# Altium schematic sheet PROC099A_PMIC_Reference.SchDoc: PMIC
size 431 x 279 mm; Date: Not shown in title block; ApprovedBy: Not shown in title block; CheckedBy: Not shown in title block; Author: Not shown in title block; CompanyName: Not shown in title block; DrawnBy: Adrian Ozer; Engineer: Not shown in title block; Organization: Not shown in title block; Address1: Not shown in title block; Address2: Not shown in title block; Address3: Not shown in title block; Address4: Not shown in title block; DocumentNumber: 4; Revision: Use project parameter SCH_Rev; SheetNumber: 4; SheetTotal: 16; PageSetup: Record=PageOptions|CenterHorizontal=True|CenterVertical=True|PrintScale=1.00|XCorrection=1.00|YCorrection=1.00|PrintKind=0|BorderSize=5000000|LeftOffset=0|BottomOffset=0|Orientation=2|PaperLength=1000|PaperWidth=1000|Scale=100|PaperSource=15|PrintQuality=600|MediaType=1|DitherType=10|PaperKind=Letter|PrintScaleMode=1; CurrentTime: Not shown in title block; CurrentDate: Not shown in title block; Time: Not shown in title block; DocumentFullPathAndName: Not shown in title block; DocumentName: Not shown in title block; ModifiedDate: Not shown in title block; ImagePath: Not shown in title block
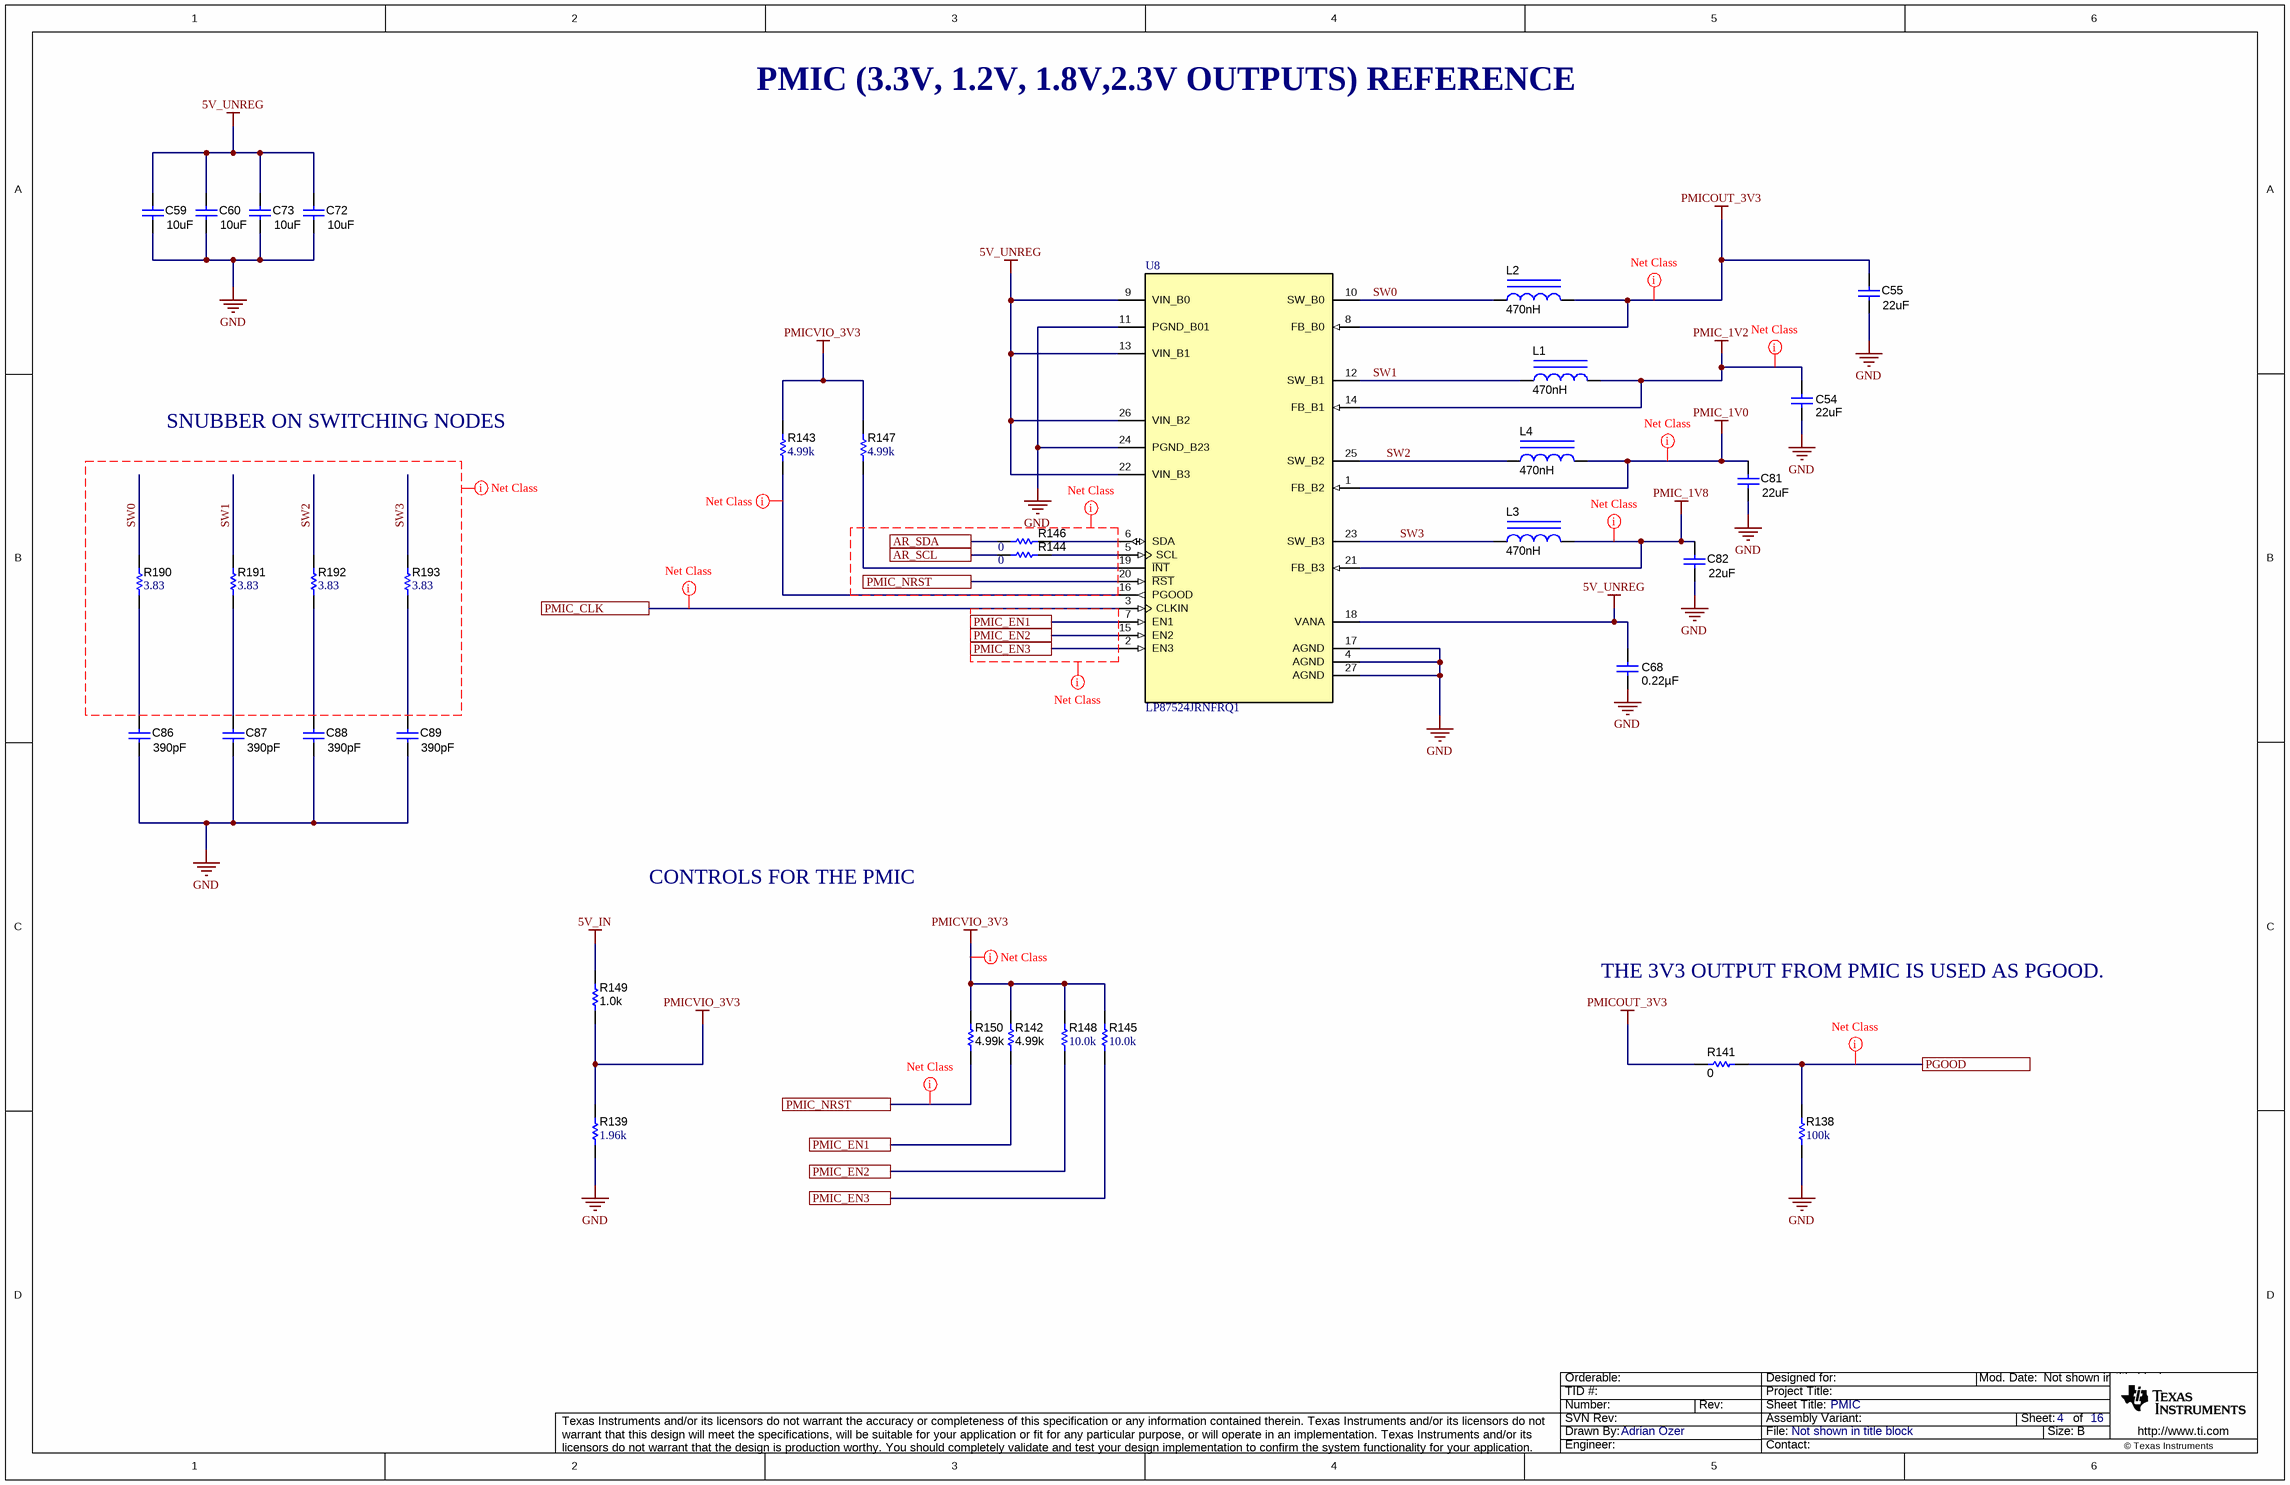
[diagram p0: PROC099A_PMIC_Reference.SchDoc]

## Parts
C54  ValueDisplayed: 22uF  [1206_180]  (hidden comment: GCM31CR71A226KE02)
C55  ValueDisplayed: 22uF  [1206_180]  (hidden comment: GCM31CR71A226KE02)
C59  ValueDisplayed: 10uF  [0805_HV1]  (hidden comment: GCM21BR71A106KE22L)
C60  ValueDisplayed: 10uF  [0805_HV1]  (hidden comment: GCM21BR71A106KE22L)
C68  ValueDisplayed: 0.22µF  [0402L]  (hidden comment: GCM155R71C224KE02D)
C72  ValueDisplayed: 10uF  [0805_HV1]  (hidden comment: GCM21BR71A106KE22L)
C73  ValueDisplayed: 10uF  [0805_HV1]  (hidden comment: GCM21BR71A106KE22L)
C81  ValueDisplayed: 22uF  [1206_180]  (hidden comment: GCM31CR71A226KE02)
C82  ValueDisplayed: 22uF  [1206_180]  (hidden comment: GCM31CR71A226KE02)
C86  ValueDisplayed: 390pF  [0402]  (hidden comment: GRM1555C1H391JA01D)
C87  ValueDisplayed: 390pF  [0402]  (hidden comment: GRM1555C1H391JA01D)
C88  ValueDisplayed: 390pF  [0402]  (hidden comment: GRM1555C1H391JA01D)
C89  ValueDisplayed: 390pF  [0402]  (hidden comment: GRM1555C1H391JA01D)
L1  ValueDisplayed: 470nH  [DFE252012P]  (hidden comment: DFE252012P-R47M=P2)
L2  ValueDisplayed: 470nH  [DFE252012P]  (hidden comment: DFE252012P-R47M=P2)
L3  ValueDisplayed: 470nH  [DFE252012P]  (hidden comment: DFE252012P-R47M=P2)
L4  ValueDisplayed: 470nH  [DFE252012P]  (hidden comment: DFE252012P-R47M=P2)
R138  ValueDisplayed: 100k  [0402L]  (hidden comment: CRCW0402100KFKED)
R139  ValueDisplayed: 1.96k  [0402L]  (hidden comment: CRCW04021K96FKED)
R141  ValueDisplayed: 0  [0402L]  (hidden comment: ERJ-2GE0R00X)
R142  ValueDisplayed: 4.99k  [0402L]  (hidden comment: ERJ-2RKF4991X)
R143  ValueDisplayed: 4.99k  [0402L]  (hidden comment: CRCW04024K99FKED)
R144  ValueDisplayed: 0  [0201_Silk]  (hidden comment: CRCW02010000Z0ED)
R145  ValueDisplayed: 10.0k  [0402L]  (hidden comment: CRCW040210K0FKED)
R146  ValueDisplayed: 0  [0201_Silk]  (hidden comment: CRCW02010000Z0ED)
R147  ValueDisplayed: 4.99k  [0402L]  (hidden comment: CRCW04024K99FKED)
R148  ValueDisplayed: 10.0k  [0402L]  (hidden comment: CRCW040210K0FKED)
R149  ValueDisplayed: 1.0k  [0402L]  (hidden comment: ERJ-2GEJ102X)
R150  ValueDisplayed: 4.99k  [0402L]  (hidden comment: ERJ-2RKF4991X)
R190  ValueDisplayed: 3.83  [0402L]  (hidden comment: CRCW04023R83FKED)
R191  ValueDisplayed: 3.83  [0402L]  (hidden comment: CRCW04023R83FKED)
R192  ValueDisplayed: 3.83  [0402L]  (hidden comment: CRCW04023R83FKED)
R193  ValueDisplayed: 3.83  [0402L]  (hidden comment: CRCW04023R83FKED)
U8  LP87524JRNFRQ1  [RNF0026C]

## Ports
AR_SCL, AR_SDA, PGOOD, PMIC_CLK, PMIC_EN1, PMIC_EN2, PMIC_EN3, PMIC_NRST

## Nets
5V_IN: R149.2
5V_UNREG: C59.2 C60.2 C68.2 C72.2 C73.2 U8.9(VIN_B0) U8.13(VIN_B1) U8.18(VANA) U8.22(VIN_B3) U8.26(VIN_B2)
GND: C54.1 C55.1 C59.1 C60.1 C68.1 C72.1 C73.1 C81.1 C82.1 C86.2 C87.2 C88.2 C89.2 R138.1 R139.1 U8.4(AGND) U8.11(PGND_B01) U8.17(AGND) U8.24(PGND_B23) U8.27(AGND)
PMIC_1V0: C81.2 L4.2 U8.1(FB_B2)
PMIC_1V2: C54.2 L1.2 U8.14(FB_B1)
PMIC_1V8: C82.2 L3.2 U8.21(FB_B3)
PMICOUT_3V3: C55.2 L2.2 R141.1 U8.8(FB_B0)
PMICVIO_3V3: R139.2 R142.2 R143.2 R145.2 R147.2 R148.2 R149.1 R150.1
AR_SCL: R144.1 ; port AR_SCL
AR_SDA: R146.2 ; port AR_SDA
PGOOD: R138.2 R141.2 ; port PGOOD
PMIC_CLK: U8.3(CLKIN) ; port PMIC_CLK
PMIC_EN1: R142.1 U8.7(EN1) ; port PMIC_EN1
PMIC_EN2: R148.1 U8.15(EN2) ; port PMIC_EN2
PMIC_EN3: R145.1 U8.2(EN3) ; port PMIC_EN3
PMIC_NRST: R150.2 U8.20(~{RST}) ; port PMIC_NRST
SW0: L2.1 R190.2 U8.10(SW_B0)
SW1: L1.1 R191.2 U8.12(SW_B1)
SW2: L4.1 R192.2 U8.25(SW_B2)
SW3: L3.1 R193.2 U8.23(SW_B3)
NetC86_1: C86.1 R190.1
NetC87_1: C87.1 R191.1
NetC88_1: C88.1 R192.1
NetC89_1: C89.1 R193.1
NetR143_1: R143.1 U8.16(PGOOD)
NetR144_2: R144.2 U8.5(SCL)
NetR146_1: R146.1 U8.6(SDA)
NetR147_1: R147.1 U8.19(~{INT})

## Layout directives
net class PWR: PGOOD, PMIC_1V0, PMIC_1V2, PMIC_1V8, PMICOUT_3V3, PMICVIO_3V3
net class GENERAL: (no net found under the mark), NetR143_1, PMIC_NRST, SW0, SW1, SW2, SW3
net class CLK: PMIC_CLK

## Notes on the sheet
- PMIC (3.3V, 1.2V, 1.8V,2.3V OUTPUTS) REFERENCE
- SNUBBER ON SWITCHING NODES
- CONTROLS FOR THE PMIC
- THE 3V3 OUTPUT FROM PMIC IS USED AS PGOOD.
- Drawn By:
- SVN Rev:
- Number:
- TID #:
- Orderable:
- Rev:
- Sheet Title:
- File:
- Project Title:
- Designed for:
- Assembly Variant:
- Mod. Date:
- Sheet:
- Size:
- of
- B
- http://www.ti.com
- Texas Instruments and/or its licensors do not warrant the accuracy or completeness of this specification or any information contained therein. Texas Instruments and/or its licensors do not warrant that this design will meet the specifications, will be suitable for your application or fit for any particular purpose, or will operate in an implementation. Texas Instruments and/or its licensors do not warrant that the design is production worthy. You should completely validate and test your design implementation to confirm the system functionality for your application.
- Engineer:
- Contact:
- © Texas Instruments

## Library data of the parts
C54 = CMP-0008811-2: CAP, CERM, 22 uF, 10 V, +/- 10%, X7R, AEC-Q200 Grade 1, 1206; Manufacturer: MuRata; TaMin_C: -55°C; Polarized: N; SizeAreaWB_mm2: 10.92; Value1: Unknown; U/M: EA; Value: 22uF; TaMax_C: 125°C; SizeZ_mm: 1.8; SizeX_mm: 3.2; SizeY_mm: 1.6; Cap_Case: 1206; Value2: 10V; SizeArea_mm2: 5.12; CompType: Capacitor; AEC Qualified: Y; Cap_F: 22µF; AEC Grade: 1; AEC Category: Q200; Publisher: Texas Instruments; TempCo: X7R; Published: 2008-06-19; RoHS: Y; MountType: SMT; PackageReference: 1206; Tolerance_%: 10%; LatestRevisionDate: 2017-03-09; PartNumber: GCM31CR71A226KE02; VDC_V: 10V; ComponentLink1Description: Datasheet link; Technology: Ceramic; ComponentLink1URL: http://psearch.en.murata.com/capacitor/product/GCM31CR71A226KE02%23.pdf
C55 C81 C82 = CMP-0008811-2: CAP, CERM, 22 uF, 10 V, +/- 10%, X7R, AEC-Q200 Grade 1, 1206; Manufacturer: MuRata; TaMin_C: -55°C; Polarized: N; SizeAreaWB_mm2: 10.92; Value1: Unknown; U/M: EA; Value: 22uF; TaMax_C: 125°C; SizeZ_mm: 1.8; SizeX_mm: 3.2; SizeY_mm: 1.6; Cap_Case: 1206; Value2: 10V; SizeArea_mm2: 5.12; AEC Qualified: Y; Cap_F: 22µF; AEC Grade: 1; AEC Category: Q200; Publisher: Texas Instruments; TempCo: X7R; Published: 2008-06-19; RoHS: Y; MountType: SMT; PackageReference: 1206; Tolerance_%: 10%; CompType: Capacitor; LatestRevisionDate: 2017-03-09; PartNumber: GCM31CR71A226KE02; VDC_V: 10V; ComponentLink1Description: Datasheet link; Technology: Ceramic; ComponentLink1URL: http://psearch.en.murata.com/capacitor/product/GCM31CR71A226KE02%23.pdf
C59 C60 C72 C73 = CMP-0008017-2: CAP, CERM, 10 uF, 10 V, +/- 10%, X7R, 0805; Manufacturer: MuRata; TaMin_C: -55°C; Polarized: N; SizeAreaWB_mm2: 6.75; Value1: Unknown; U/M: EA; Value: 10uF; TaMax_C: 125°C; SizeZ_mm: 1.45; SizeX_mm: 2; SizeY_mm: 1.25; Cap_Case: 0805; Value2: 10V; SizeArea_mm2: 2.5; CompType: Capacitor; Cap_F: 10µF; AEC Category: Q200; Supplier Part Number 2: 06AC6014; Publisher: Texas Instruments; Supplier 2: Newark; Supplier Part Number 3: 81-GCM21BR71A106KE2L; TempCo: X7R; Supplier 3: Mouser; Published: 2008-06-19; RoHS: Y; MountType: SMT; Supplier 1: Digi-Key; PackageReference: 0805; Tolerance_%: 10%; LatestRevisionDate: 2017-03-09; PartNumber: GCM21BR71A106KE22L; AEC Qualified: ?; VDC_V: 10V; ComponentLink1Description: Datasheet link; Supplier Part Number 1: 490-10674-1-ND; Technology: Ceramic; ComponentLink1URL: http://www.murata.com/products/catalog/pdf/c03e.pdf
C68 = CMP-0078265-1: CAP, CERM, 0.22 µF, 16 V,+/- 10%, X7R, AEC-Q200 Grade 1, 0402; Manufacturer: MuRata; TaMin_C: -55°C; Polarized: N; SizeAreaWB_mm2: 3; U/M: EA; Value: 0.22uF; TaMax_C: 125°C; SizeZ_mm: 0.6; SizeX_mm: 1; SizeY_mm: 0.5; Cap_Case: 0402; Value2: 16V; CompType: Capacitor; AEC Qualified: Y; Cap_F: 220nF; AEC Category: Q200; ComponentLink1URL: http://psearch.en.murata.com/capacitor/product/GCM155R71C224KE02%23.pdf; Supplier Part Number 2: 81-GCM155R71C224KE2D; Supplier 2: Mouser; TempCo: X7R; RoHS: Y; MountType: SMT; Supplier 1: Digi-Key; PackageReference: 0402; Tolerance_%: 10%; SizeArea_mm2: 0.5; PartNumber: GCM155R71C224KE02D; VDC_V: 16V; ComponentLink1Description: Datasheet link; AEC Grade: 1; Supplier Part Number 1: 490-10671-1-ND; Technology: Ceramic
C86-C89 = CMP-0006459-1: CAP, CERM, 390 pF, 50 V, +/- 5%, C0G/NP0, 0402; Manufacturer: MuRata; TaMin_C: -55°C; Polarized: N; SizeAreaWB_mm2: 3; Value1: Unknown; U/M: EA; Value: 390pF; TaMax_C: 125°C; SizeZ_mm: 0.6; SizeX_mm: 1; SizeY_mm: 0.5; Value2: 50V; AEC Category: Q200; ComponentLink1URL: http://search.murata.co.jp/Ceramy/PnsearchViewAction.do?HnOFG=ON&HnNFG=ON&SEL_CNT=50&sLang=en&sKey=GRM1555C1H391JA01D&x=9&y=9&search=startwith; Supplier Part Number 2: 81-GRM1555C1H391JA01; Publisher: Texas Instruments; Supplier 2: Mouser; TempCo: C0G/NP0; Published: 2008-06-19; RoHS: Y; MountType: SMT; Supplier 1: Digi-Key; PackageReference: 0402; Tolerance_%: 5%; Cap_Case: 0402; SizeArea_mm2: 0.5; CompType: Capacitor; LatestRevisionDate: 2017-03-09; PartNumber: GRM1555C1H391JA01D; AEC Qualified: ?; Cap_F: 390pF; VDC_V: 50V; ComponentLink1Description: Datasheet link; Supplier Part Number 1: 490-1296-1-ND; Technology: Ceramic
L1-L4 = CMP-0058946-1: Inductor, Shielded, 470 nH, 4.7 A, 0.021 ohm, SMD; Manufacturer: MuRata Toko; Isat: 6.4A @ 30% inductance drop; Irms: 4.7A @ 40C rise; SizeAreaWB_mm2: 10.5; DCR_ohm: 0.021; Value: 470nH; Imax_A: 4.7A; SizeZ_mm: 1.2; SizeX_mm: 2.5; SizeY_mm: 2; SizeArea_mm2: 5; AEC Category: Q200; ComponentLink1URL: http://www.toko.co.jp/products/pdf/inductors/dfe252012p.pdf; Publisher: Texas Instruments; Published: 2008-06-26; RoHS: Y; Value1: 0.021 ohm; Material: ?; MountType: SMT; PackageReference: 1008; Value2: 4.7A; CompType: Inductor; Ind_H: 470nH; LatestRevisionDate: 2017-06-02; PartNumber: DFE252012P-R47M=P2; AEC Qualified: ?; ComponentLink1Description: Datasheet link; Technology: Shielded
R138 = CMP-0025950-3: RES, 100 k, 1%, 0.063 W, AEC-Q200 Grade 0, 0402; Manufacturer: Vishay-Dale; Power_W: 63mW; TempCo: 100 ppm/C; Value: 100k; EIA_Code: E96; SizeX_mm: 1; SizeY_mm: 0.5; SizeZ_mm: 0.6; Value2: 0.063W; AEC Qualified: Y; VDC_V: 50V; AEC Category: Q200; AEC Grade: 0; Supplier Part Number 2: 52K6607; Supplier 2: Newark; Supplier Part Number 3: 71-CRCW0402-100K-E3; Supplier 3: Mouser; Value_Code: 100k; RoHS: E; Value1: 1%; MountType: SMT; Supplier 1: Digi-Key; PackageReference: 0402; Tolerance_%: 1%; Res_ohm: 100k; SizeArea_mm2: 0.5; CompType: Resistor; PartNumber: CRCW0402100KFKED; ComponentLink1Description: Datasheet link; Supplier Part Number 1: 541-100KLCT-ND; Technology: Thick Film; ComponentLink1URL: http://www.vishay.com/docs/20035/dcrcwe3.pdf
R139 = CMP-0026099-2: RES, 1.96 k, 1%, 0.063 W, AEC-Q200 Grade 0, 0402; Manufacturer: Vishay-Dale; Power_W: 63mW; TempCo: 100 ppm/C; Value_Code: 1k96; Value: 1.96k; EIA_Code: E96; SizeX_mm: 1; SizeY_mm: 0.5; SizeZ_mm: 0.6; Value2: 0.063W; AEC Qualified: Y; VDC_V: 50V; AEC Category: Q200; AEC Grade: 0; ComponentLink1URL: http://www.vishay.com/docs/20035/dcrcwe3.pdf; Supplier Part Number 2: 52K6592; Supplier 2: Newark; Supplier Part Number 3: 71-CRCW0402-1.96K-E3; Supplier 3: Mouser; RoHS: E; Value1: 1%; MountType: SMT; Supplier 1: Digi-Key; PackageReference: 0402; Tolerance_%: 1%; Res_ohm: 1.96k; SizeArea_mm2: 0.5; CompType: Resistor; PartNumber: CRCW04021K96FKED; ComponentLink1Description: Datasheet link; Supplier Part Number 1: 541-1.96KLCT-ND; Technology: Thick Film
R141 = CMP-0026992-2: RES, 0, 5%, 0.063 W, 0402; Manufacturer: Panasonic; Power_W: 63mW; TempCo: 600 ppm/C; Value_Code: 0000; U/M: EA; Value: 0; EIA_Code: E24; SizeX_mm: 1; SizeY_mm: 0.5; SizeZ_mm: 0.6; Value2: 0.063W; VDC_V: 50V; AEC Category: Q200; Supplier Part Number 2: 65T8307; Publisher: Texas Instruments; Supplier 2: Newark; Supplier Part Number 3: 667-ERJ-2GE0R00X; Supplier 3: Mouser; Published: 2008-06-26; RoHS: Y; Value1: 5%; MountType: SMT; Supplier 1: Digi-Key; PackageReference: 0402; Tolerance_%: 5%; Res_ohm: 0; SizeArea_mm2: 0.5; CompType: Resistor; LatestRevisionDate: 2017-03-09; PartNumber: ERJ-2GE0R00X; AEC Qualified: ?; ComponentLink1Description: Datasheet link; Supplier Part Number 1: P0.0JCT-ND; Technology: Thick Film; ComponentLink1URL: http://www.panasonic.com/industrial/components/pdf/AOA0000CE1.pdf
R142 R150 = CMP-0026701-1: RES, 4.99 k, 1%, 0.1 W, AEC-Q200 Grade 0, 0402; Manufacturer: Panasonic; Power_W: 100mW; TempCo: 100 ppm/C; Value_Code: 4k99; U/M: EA; Value: 4.99k; EIA_Code: E96; SizeX_mm: 1; SizeY_mm: 0.5; SizeZ_mm: 0.6; Value2: 0.1W; AEC Qualified: Y; VDC_V: 50V; AEC Grade: 0; AEC Category: Q200; ComponentLink1URL: http://industrial.panasonic.com/cdbs/www-data/pdf/RDA0000/AOA0000C86.pdf; Supplier Part Number 2: 73T6529; Publisher: Texas Instruments; Supplier 2: Newark; Supplier Part Number 3: 667-ERJ-2RKF4991X; Supplier 3: Mouser; Published: 2008-06-26; RoHS: Y; Value1: 1%; MountType: SMT; Supplier 1: Digi-Key; PackageReference: 0402; Tolerance_%: 1%; Res_ohm: 4.99k; SizeArea_mm2: 0.5; CompType: Resistor; LatestRevisionDate: 2017-03-09; PartNumber: ERJ-2RKF4991X; ComponentLink1Description: Datasheet link; Supplier Part Number 1: P4.99KLCT-ND; Technology: Thick Film
R143 R147 = CMP-0026414-2: RES, 4.99 k, 1%, 0.063 W, AEC-Q200 Grade 0, 0402; Manufacturer: Vishay-Dale; Power_W: 63mW; TempCo: 100 ppm/C; Value_Code: 4k99; Value: 4.99k; EIA_Code: E96; SizeX_mm: 1; SizeY_mm: 0.5; SizeZ_mm: 0.6; Value2: 0.063W; AEC Qualified: Y; VDC_V: 50V; AEC Category: Q200; AEC Grade: 0; ComponentLink1URL: http://www.vishay.com/docs/20035/dcrcwe3.pdf; Supplier Part Number 2: 52K7048; Supplier 2: Newark; Supplier Part Number 3: 71-CRCW0402-4.99K-E3; Supplier 3: Mouser; RoHS: E; Value1: 1%; MountType: SMT; Supplier 1: Digi-Key; PackageReference: 0402; Tolerance_%: 1%; Res_ohm: 4.99k; SizeArea_mm2: 0.5; CompType: Resistor; PartNumber: CRCW04024K99FKED; ComponentLink1Description: Datasheet link; Supplier Part Number 1: 541-4.99KLCT-ND; Technology: Thick Film
R144 R146 = CMP-0027008-4: RES, 0, 5%, 0.05 W, 0201; Manufacturer: Vishay-Dale; Power_W: 50mW; TempCo: ppm/C; Value_Code: 0000; Value: 0; EIA_Code: E24; SizeX_mm: 0.6; SizeY_mm: 0.3; SizeZ_mm: 0.26; Value2: 0.05W; SizeArea_mm2: 0.18; AEC Qualified: N; AEC Category: Q200; RoHS: E; Value1: 5%; MountType: SMT; Supplier 1: Newark; PackageReference: 0201; Tolerance_%: 5%; Res_ohm: 0; CompType: Resistor; PartNumber: CRCW02010000Z0ED; ComponentLink1Description: Datasheet link; AEC Grade: N/A; Supplier Part Number 1: 72M6743; Technology: Thick Film; ComponentLink1URL: http://www.vishay.com/docs/20052/crcw0201e3.pdf
R145 = CMP-0025958-3: RES, 10.0 k, 1%, 0.063 W, AEC-Q200 Grade 0, 0402; Manufacturer: Vishay-Dale; Power_W: 63mW; TempCo: 100 ppm/C; Value_Code: 10k0; Value: 10.0k; EIA_Code: E96; Res_ohm: 10k; SizeX_mm: 1; SizeY_mm: 0.5; SizeZ_mm: 0.6; Value2: 0.063W; CompType: Resistor; AEC Qualified: Y; VDC_V: 50V; AEC Category: Q200; AEC Grade: 0; Supplier Part Number 2: 52K6595; Supplier 2: Newark; Supplier Part Number 3: 71-CRCW0402-10K-E3; Supplier 3: Mouser; RoHS: E; Value1: 1%; MountType: SMT; Supplier 1: Digi-Key; PackageReference: 0402; Tolerance_%: 1%; SizeArea_mm2: 0.5; PartNumber: CRCW040210K0FKED; ComponentLink1Description: Datasheet link; Supplier Part Number 1: 541-10.0KLCT-ND; Technology: Thick Film; ComponentLink1URL: http://www.vishay.com/docs/20035/dcrcwe3.pdf
R148 = CMP-0025958-3: RES, 10.0 k, 1%, 0.063 W, AEC-Q200 Grade 0, 0402; Manufacturer: Vishay-Dale; Power_W: 63mW; TempCo: 100 ppm/C; Value_Code: 10k0; Value: 10.0k; EIA_Code: E96; Res_ohm: 10k; SizeX_mm: 1; SizeY_mm: 0.5; SizeZ_mm: 0.6; Value2: 0.063W; AEC Qualified: Y; VDC_V: 50V; AEC Category: Q200; AEC Grade: 0; Supplier Part Number 2: 52K6595; Supplier 2: Newark; Supplier Part Number 3: 71-CRCW0402-10K-E3; Supplier 3: Mouser; RoHS: E; Value1: 1%; MountType: SMT; Supplier 1: Digi-Key; PackageReference: 0402; Tolerance_%: 1%; SizeArea_mm2: 0.5; CompType: Resistor; PartNumber: CRCW040210K0FKED; ComponentLink1Description: Datasheet link; Supplier Part Number 1: 541-10.0KLCT-ND; Technology: Thick Film; ComponentLink1URL: http://www.vishay.com/docs/20035/dcrcwe3.pdf
R149 = CMP-0078193-1: RES, 1.0 k, 5%, 0.1 W, AEC-Q200 Grade 0, 0402; Manufacturer: Panasonic; Value_Code: 1k00; SizeArea_mm2: 0.5; AEC Qualified: Y; AEC Category: Q200; Res_ohm: 1k; Value: 1.0k; SizeZ_mm: 0.6; Green_REACh: Passed; EIA_Code: E24; TempCo: 200 ppm/C; AEC Grade: 0; Power_W: 100mW; VDC_V: 50V; Value2: 0.1W; Green_Lifecycle: Active; U/M: EA; SizeX_mm: 1; ComponentLink1Description: Datasheet link; RoHS: Y; Supplier Part Number 3: 667-ERJ-2GEJ102X; Tolerance_%: 5%; Supplier 1: Digi-Key; Green_EU RoHS: Passed with Exemption; PackageReference: 0402; Technology: Thick Film; PartNumber: ERJ-2GEJ102X; Supplier Part Number 2: 65T8247; Supplier 2: Newark; SizeY_mm: 0.5; ComponentLink1URL: https://industrial.panasonic.com/cdbs/www-data/pdf/RDA0000/DMA0000COL9.pdf; Value1: 5%; CompType: Resistor; MountType: SMT; Supplier Part Number 1: P1.0KJCT-ND; Supplier 3: Mouser; Green_EU RoHS-2: Passed
R190-R193 = CMP-0026363-2: RES, 3.83, 1%, 0.063 W, AEC-Q200 Grade 0, 0402; Manufacturer: Vishay-Dale; Power_W: 63mW; TempCo: 100 ppm/C; Value_Code: 3R83; Value: 3.83; EIA_Code: E96; SizeX_mm: 1; SizeY_mm: 0.5; SizeZ_mm: 0.6; Value2: 0.063W; AEC Qualified: Y; VDC_V: 50V; AEC Category: Q200; AEC Grade: 0; ComponentLink1URL: http://www.vishay.com/docs/20035/dcrcwe3.pdf; Supplier Part Number 2: 71-CRCW04023R83FKED; Supplier 2: Mouser; RoHS: E; Value1: 1%; MountType: SMT; Supplier 1: Digi-Key; PackageReference: 0402; Tolerance_%: 1%; Res_ohm: 3.83; SizeArea_mm2: 0.5; CompType: Resistor; PartNumber: CRCW04023R83FKED; ComponentLink1Description: Datasheet link; Supplier Part Number 1: 541-3.83LLCT-ND; Technology: Thick Film
U8 = CMP-0079120-1: 4-A + 2.5-A + Two 1.5-A Buck Converters With Integrated Switches, RNF0026C (VQFN-HR-26); Alternate PartNumber: LP87524JRNFTQ1; Alternate Manufacturer: Texas Instruments; SizeAreaWB_mm2: 27.5; SizeZ_mm: 0.9; SizeX_mm: 4; SizeY_mm: 4.5; SizeArea_mm2: 18; CompType: IC; AEC Qualified: Y; AEC Category: Q200; ComponentLink1URL: http://www.ti.com/lit/ds/symlink/lp87524-q1.pdf; PackageDescription: VQFN-HR-26; RoHS: Y; MountType: SMT; ComponentLink2URL: http://www.ti.com/product/lp87524-q1; ComponentLink2Description: Product Folder; Manufacturer: Texas Instruments; PackageReference: RNF0026C; PartNumber: LP87524JRNFRQ1; ComponentLink1Description: Datasheet Link